# Altium schematic sheet Display.SchDoc
size A4; SheetNumber: 2; SheetTotal: 4
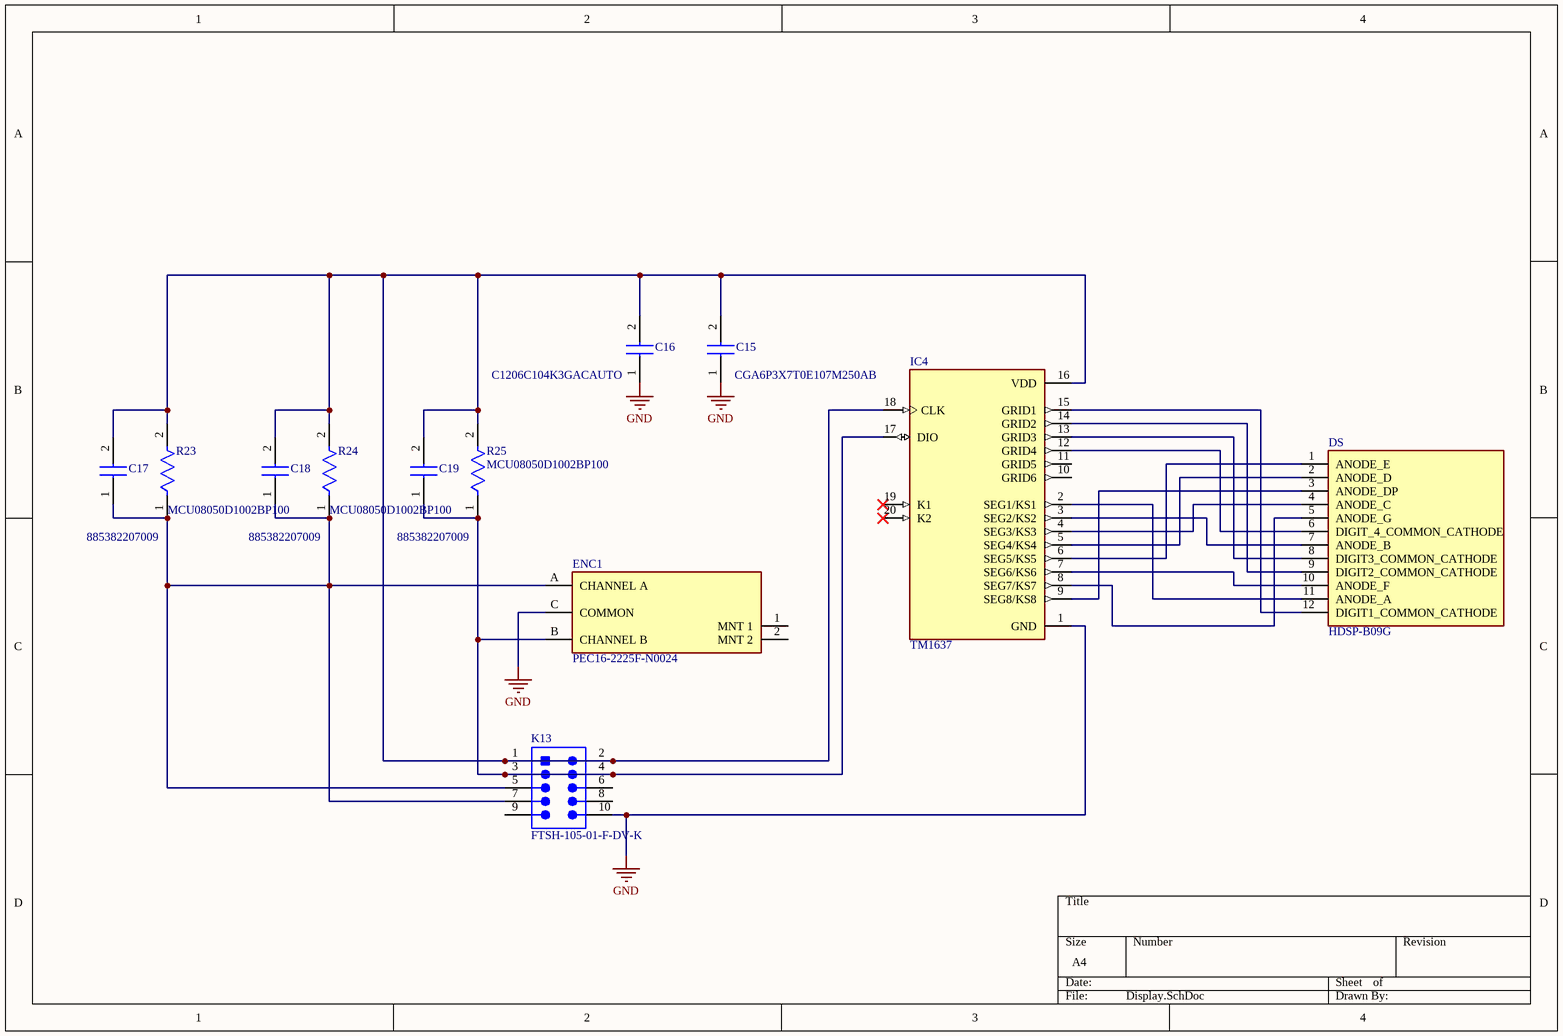
[diagram p0: Display.SchDoc]

## Parts
C15  CGA6P3X7T0E107M250AB  [CAPC3225X280N]
C16  C1206C104K3GACAUTO  [CAPC3216X180N]
C17  885382207009  [CAPC2012X135N]
C18  885382207009  [CAPC2012X135N]
C19  885382207009  [CAPC2012X135N]
DS  HDSP-B09G  [AVAGO_HDSP-B09G]
ENC1  PEC16-2225F-N0024  [FP-PEC16-2225F-N0024-MFG]
IC4  TM1637  [DIP778W43P254L2612H431Q20N]
K13  FTSH-105-01-F-DV-K  [SMTC-FTSH-105-01-L-DV-K_V]
R23  MCU08050D1002BP100  [FP-MCU0805-IPC_C]
R24  MCU08050D1002BP100  [FP-MCU0805-IPC_C]
R25  MCU08050D1002BP100  [FP-MCU0805-IPC_C]

## Nets
GND: C15.1 C16.1 ENC1.C(COMMON) IC4.1(GND) K13.10
NetC15_2: C15.2 C16.2 C17.2 C18.2 C19.2 IC4.16(VDD) IC4.18(CLK) K13.1 K13.2 R23.2 R24.2 R25.2
NetC17_1: C17.1 C18.1 ENC1.A(CHANNEL_A) K13.5 K13.7 R23.1 R24.1
NetC19_1: C19.1 ENC1.B(CHANNEL_B) IC4.17(DIO) K13.3 K13.4 R25.1
NetDS_1: DS.1(ANODE_E) IC4.6(SEG5/KS5)
NetDS_2: DS.2(ANODE_D) IC4.5(SEG4/KS4)
NetDS_3: DS.3(ANODE_DP) IC4.9(SEG8/KS8)
NetDS_4: DS.4(ANODE_C) IC4.4(SEG3/KS3)
NetDS_5: DS.5(ANODE_G) IC4.8(SEG7/KS7)
NetDS_6: DS.6(DIGIT_4_COMMON_CATHODE) IC4.12(GRID4)
NetDS_7: DS.7(ANODE_B) IC4.3(SEG2/KS2)
NetDS_8: DS.8(DIGIT3_COMMON_CATHODE) IC4.13(GRID3)
NetDS_9: DS.9(DIGIT2_COMMON_CATHODE) IC4.14(GRID2)
NetDS_10: DS.10(ANODE_F) IC4.7(SEG6/KS6)
NetDS_11: DS.11(ANODE_A) IC4.2(SEG1/KS1)
NetDS_12: DS.12(DIGIT1_COMMON_CATHODE) IC4.15(GRID1)

Not connected (* = marked no-connect by the designer): ENC1 1(MNT_1) 2(MNT_2); IC4 10(GRID6) 11(GRID5) 19(K1)* 20(K2)*; K13 6 8 9

## Library data of the parts
C15 = CGA6P3X7T0E107M250AB: Capacitor; Manufacturer_Name: TDK; Datasheet Link: https://product.tdk.com/system/files/dam/doc/product/capacitor/ceramic/mlcc/catalog/mlcc_automotive_general_en.pdf; Height: 2.8mm; Manufacturer_Part_Number: CGA6P3X7T0E107M250AB
C16 = C1206C104K3GACAUTO: Capacitor; Manufacturer_Name: Kemet; Datasheet Link: https://www.kemet.com/specsheet/C1206C104K3GACAUTO; Height: 1.8mm; Manufacturer_Part_Number: C1206C104K3GACAUTO
C17-C19 = 885382207009: Capacitor; Manufacturer_Name: Wurth Elektronik; Datasheet Link: https://katalog.we-online.com/pbs/datasheet/885382207009.pdf; Height: 1.35mm; Manufacturer_Part_Number: 885382207009
DS = HDSP-B09G: Display Modules - LED Character and Numeric Green 7-Segment Clock 4 Character Common Cathode 2.2V 20mA 0.752 H x 2.016 W x 0.315 D _19.10mm x 51.20mm x 8.00mm_ 12-DIP _0.600, 15.24mm_; MF: Broadcom Limited; Package: DIP-12 Broadcom; MP: HDSP-B09G; Value: *; Availability: Unavailable; SnapEDA_Link: https://www.snapeda.com/parts/HDSP-B09G/Broadcom%20Limited/view-part/1797524/?ref=snap; Price: None
ENC1 = CMP-07421-000055-1: ROTARY ENCODER MECHANICAL 24PPR; Operating Supply Voltage: 5V; Built in Switch: No; Output Type: Quadrature; Pulses per Revolution: 24; Number of Channels: 2; Detent: Yes; Min Operating Temperature: -30°C; Package Quantity: 50; Type: Mechanical; Number of Pins: 3; Packaging: Bulk; Max Operating Temperature: 70°C; Series: PEC16; Mount: Through Hole; Encoder Type: Mechanical; RoHS Compliant: Yes; Termination: PC Pin; Orientation: Right Angle
IC4 = TM1637: LED Drive Control Special Circuit; MF: Titan Micro Electronics; Package: Package; Availability: Not in stock; SnapEDA_Link: https://www.snapeda.com/parts/TM1637/Titan+Micro+Electronics/view-part/?ref=snap; MP: TM1637; Check_prices: https://www.snapeda.com/parts/TM1637/Titan+Micro+Electronics/view-part/?ref=eda; Value: *; Price: None
K13 = CMP-2000-05352-1: Male Header, Pitch 1.27 mm, 2 x 5 Position, Height 6.12 mm, RoHS, Tube; Manufacturer: Samtec; Number of Positions: 10; Connector Type: Header,Shrouded; Number of Positions Loaded: All; Row Spacing: 0.050"(1.27mm); Fastening Type: -; Package Reference: FTSH-105-01-L-DV-K; Termination: Solder; Package URL: http://suddendocs.samtec.com/prints/ftsh-1xx-xx-xxx-dv-xxx-footprint.pdf; Number of Rows: 2; Contact Finish Thickness: 3µin(0.08µm); Contact Type: MalePin; Manufacturer URL: http://www.samtec.com/; Contact Mating Length: 0.120"(3.05mm); Pitch: 0.050"(1.27mm); Series: FTSH; Features: -; Contact Finish: Gold; Color: Black; Family: RectangularConnectors-Headers,MalePins; Datasheet URL: http://suddendocs.samtec.com/prints/ftsh-1xx-xx-xxx-dv-xxx-mkt.pdf; Package Description: Male Header, Pitch 1.27 mm, 2 x 5 Position, Height 5.97 mm, Tail Length 4.32 mm; Mounting Type: SurfaceMount; Datasheet Version: Rev. ET, 10/1995; Category: Connectors,Interconnects; Packaging: Tube
R23-R25 = CMP-02407-010458-1: RES 1.05K OHM 0.5% 1/5W 0805; Power Rating: 125mW; Voltage Rating (DC): 100V; Tolerance: 0.1%; Resistance: 10kR; Temperature Coefficient: 25ppm/°C; Min Operating Temperature: -55°C; Military Standard: Not; Composition: Thin Film; Max Power Dissipation: 125mW; Lead Free: Lead Free; Case/Package: 0805; Contact Plating: Tin; Depth: 1.25mm; Number of Terminations: 2; Height: 0.022inch; Package Quantity: 1000; Max Operating Temperature: 125°C; Packaging: Tape and Reel; Mount: Surface Mount; Radiation Hardening: No; Length: 2mm; Width: 0.049inch